# Altium schematic sheet Sheet1.SchDoc
size C; SheetNumber: 1; SheetTotal: 1
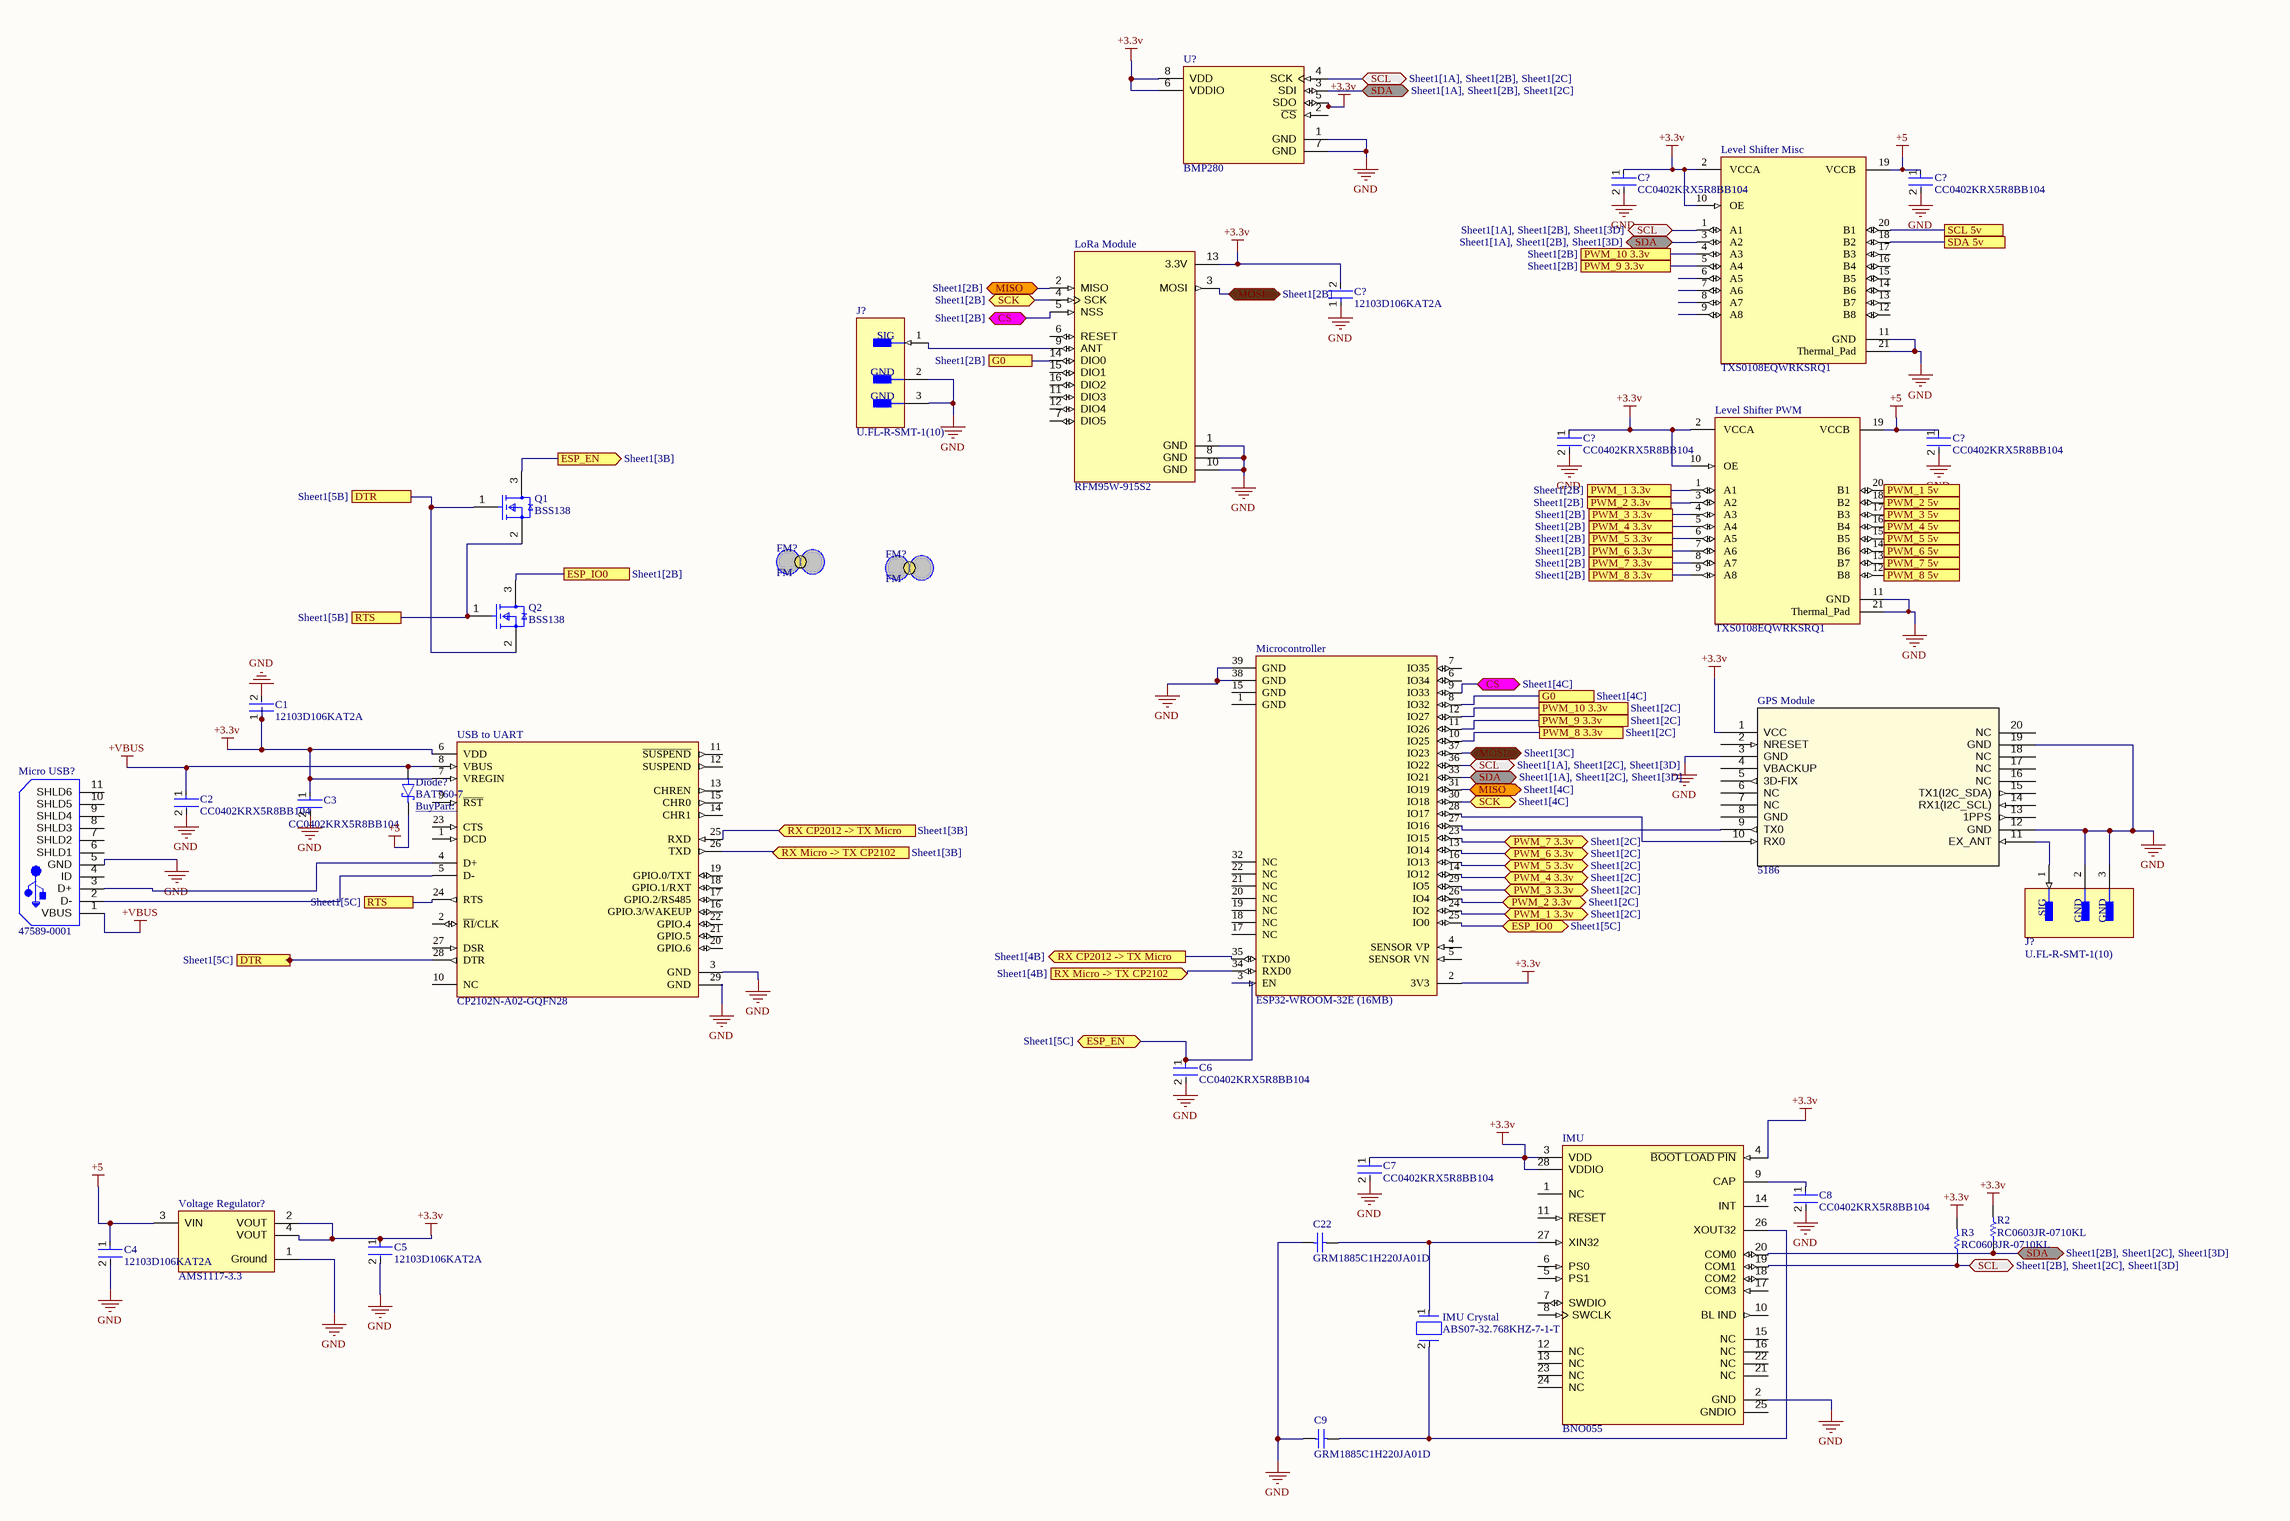
[diagram p0: Sheet1.SchDoc]

## Parts
(Parts that share a designator on the sheet are numbered #1, #2 ... from top to bottom, then left to right.)
C1  12103D106KAT2A  [FP-1210-L_3_3_0_4-W_2_5_0-MFG]
C2  CC0402KRX5R8BB104  [FP-CC0402-MFG]
C3  CC0402KRX5R8BB104  [FP-CC0402-MFG]
C4  12103D106KAT2A  [FP-1210-L_3_3_0_4-W_2_5_0-MFG]
C5  12103D106KAT2A  [FP-1210-L_3_3_0_4-W_2_5_0-MFG]
C6  CC0402KRX5R8BB104  [FP-CC0402-MFG]
C7  CC0402KRX5R8BB104  [FP-CC0402-MFG]
C8  CC0402KRX5R8BB104  [FP-CC0402-MFG]
C9  GRM1885C1H220JA01D  [CAPC1608X90X35ML10T15]
C22  GRM1885C1H220JA01D  [CAPC1608X90X35ML10T15]
C?#1  CC0402KRX5R8BB104  [FP-CC0402-MFG]
C?#2  CC0402KRX5R8BB104  [FP-CC0402-MFG]
C?#3  12103D106KAT2A  [FP-1210-L_3_3_0_4-W_2_5_0-MFG]
C?#4  CC0402KRX5R8BB104  [FP-CC0402-MFG]
C?#5  CC0402KRX5R8BB104  [FP-CC0402-MFG]
Diode?  BAT760-7  [SOD2513X120N]
FM?#1  FM  [PCBComponent_1]
FM?#2  FM  [PCBComponent_1]
GPS_Module  5186  [CD-PA1616D_ADA]
IMU  BNO055  [FP-BNO055-MFG]
IMU_Crystal  ABS07-32.768KHZ-7-1-T  [FP-ABS07-MFG]
J?#1  U.FL-R-SMT-1(10)  [FP-U_FL-R-SMT-1_10-MFG]
J?#2  U.FL-R-SMT-1(10)  [FP-U_FL-R-SMT-1_10-MFG]
Level_Shifter_Misc  TXS0108EQWRKSRQ1  [RKS0020B_MFG]
Level_Shifter_PWM  TXS0108EQWRKSRQ1  [RKS0020B_MFG]
LoRa_Module  RFM95W-915S2  [XCVR_RFM95W-915S2]
Micro_USB?  47589-0001  [MOLX-47589-0001_V]
Microcontroller  ESP32-WROOM-32E (16MB)  [FP-ESP32-WROOM-32E_16MB-MFG]
Q1  BSS138  [FP-318-08-IPC_B]
Q2  BSS138  [FP-318-08-IPC_B]
R2  RC0603JR-0710KL  [RESC1608X55X25ML10T15]
R3  RC0603JR-0710KL  [RESC1608X55X25ML10T15]
U?  BMP280  [FP-BMP280-MFG]
USB_to_UART  CP2102N-A02-GQFN28  [FP-CP2102N-A02-GQFN28-MFG]
Voltage_Regulator?  AMS1117-3.3  [FP-AMS1117-IPC_C]

## Ports
CS (bidir, see Sheet1[2B]), CS (bidir, see Sheet1[4C]), DTR (see Sheet1[5B]), DTR (see Sheet1[5C]), ESP_EN (bidir, see Sheet1[5C]), ESP_EN (out, see Sheet1[3B]), ESP_IO0 (bidir, see Sheet1[5C]), ESP_IO0 (see Sheet1[2B]), G0 (see Sheet1[2B]), G0 (see Sheet1[4C]), MISO (bidir, see Sheet1[2B]), MISO (bidir, see Sheet1[4C]), MOSI (bidir, see Sheet1[2B]), MOSI (bidir, see Sheet1[3C]), PWM_1 3.3v (bidir, see Sheet1[2C]), PWM_1 3.3v (see Sheet1[2B]), PWM_1 5v, PWM_2 3.3v (bidir, see Sheet1[2C]), PWM_2 3.3v (see Sheet1[2B]), PWM_2 5v, PWM_3 3.3v (bidir, see Sheet1[2C]), PWM_3 3.3v (see Sheet1[2B]), PWM_3 5v, PWM_4 3.3v (bidir, see Sheet1[2C]), PWM_4 3.3v (see Sheet1[2B]), PWM_4 5v, PWM_5 3.3v (bidir, see Sheet1[2C]), PWM_5 3.3v (see Sheet1[2B]), PWM_5 5v, PWM_6 3.3v (bidir, see Sheet1[2C]), PWM_6 3.3v (see Sheet1[2B]), PWM_6 5v, PWM_7 3.3v (bidir, see Sheet1[2C]), PWM_7 3.3v (see Sheet1[2B]), PWM_7 5v, PWM_8 3.3v (see Sheet1[2B]), PWM_8 3.3v (see Sheet1[2C]), PWM_8 5v, PWM_9 3.3v (see Sheet1[2B]), PWM_9 3.3v (see Sheet1[2C]), PWM_10 3.3v (see Sheet1[2B]), PWM_10 3.3v (see Sheet1[2C]), RTS (see Sheet1[5B]), RTS (see Sheet1[5C]), RX CP2012 -> TX Micro (in, see Sheet1[3B]), RX CP2012 -> TX Micro (out, see Sheet1[4B]), RX Micro -> TX CP2102 (in, see Sheet1[3B]), RX Micro -> TX CP2102 (in, see Sheet1[4B]), SCK (bidir, see Sheet1[2B]), SCK (bidir, see Sheet1[4C]), SCL 5v, SCL (bidir, see Sheet1[1A], Sheet1[2B], Sheet1[2C]), SCL (bidir, see Sheet1[1A], Sheet1[2B], Sheet1[3D]), SCL (bidir, see Sheet1[1A], Sheet1[2C], Sheet1[3D]), SCL (bidir, see Sheet1[2B], Sheet1[2C], Sheet1[3D]), SDA 5v, SDA (bidir, see Sheet1[1A], Sheet1[2B], Sheet1[2C]), SDA (bidir, see Sheet1[1A], Sheet1[2B], Sheet1[3D]), SDA (bidir, see Sheet1[1A], Sheet1[2C], Sheet1[3D]), SDA (bidir, see Sheet1[2B], Sheet1[2C], Sheet1[3D])

## Nets
+3.3v: C1.1 C3.1 C5.1 C7.1 C?#1.1 C?#3.2 C?#4.1 GPS_Module.1(VCC) IMU.3(VDD) IMU.4(~{BOOT_LOAD_PIN}) IMU.28(VDDIO) Level_Shifter_Misc.2(VCCA) Level_Shifter_Misc.10(OE) Level_Shifter_PWM.2(VCCA) Level_Shifter_PWM.10(OE) LoRa_Module.13(3.3V) Microcontroller.2(3V3) R2.2 R3.2 U?.5(SDO) U?.6(VDDIO) U?.8(VDD) USB_to_UART.6(VDD) USB_to_UART.7(VREGIN) Voltage_Regulator?.2(VOUT) Voltage_Regulator?.4(VOUT)
+5: C4.1 C?#2.1 C?#5.1 Diode?.C(K) Level_Shifter_Misc.19(VCCB) Level_Shifter_PWM.19(VCCB) Voltage_Regulator?.3(VIN)
+VBUS: C2.1 Diode?.A Micro_USB?.1(VBUS) USB_to_UART.8(VBUS)
GND: C1.2 C2.2 C3.2 C4.2 C5.2 C6.2 C7.2 C8.2 C9.1 C22.1 C?#1.2 C?#2.2 C?#3.1 C?#4.2 C?#5.2 GPS_Module.3(GND) GPS_Module.12(GND) GPS_Module.19(GND) IMU.2(GND) J?#1.2(GND) J?#1.3(GND) J?#2.2(GND) J?#2.3(GND) Level_Shifter_Misc.11(GND) Level_Shifter_Misc.21(Thermal_Pad) Level_Shifter_PWM.11(GND) Level_Shifter_PWM.21(Thermal_Pad) LoRa_Module.1(GND) LoRa_Module.8(GND) LoRa_Module.10(GND) Micro_USB?.5(GND) Microcontroller.38(GND) Microcontroller.39(GND) U?.1(GND) U?.7(GND) USB_to_UART.3(GND) USB_to_UART.29(GND) Voltage_Regulator?.1(Ground)
CS: LoRa_Module.5(NSS) Microcontroller.9(IO33) ; port CS
DTR: Q1.1(G) Q2.2(S) USB_to_UART.28(DTR) ; port DTR
ESP_EN: C6.1 Microcontroller.3(EN) Q1.3(D) ; port ESP_EN
ESP_IO0: Microcontroller.25(IO0) Q2.3(D) ; port ESP_IO0
G0: LoRa_Module.14(DIO0) Microcontroller.8(IO32) ; port G0
MISO: LoRa_Module.2(MISO) Microcontroller.31(IO19) ; port MISO
MOSI: LoRa_Module.3(MOSI) Microcontroller.37(IO23) ; port MOSI
PWM_1 3.3v: Level_Shifter_PWM.1(A1) Microcontroller.24(IO2) ; port PWM_1 3.3v
PWM_1 5v: Level_Shifter_PWM.20(B1) ; port PWM_1 5v
PWM_2 3.3v: Level_Shifter_PWM.3(A2) Microcontroller.26(IO4) ; port PWM_2 3.3v
PWM_2 5v: Level_Shifter_PWM.18(B2) ; port PWM_2 5v
PWM_3 3.3v: Level_Shifter_PWM.4(A3) Microcontroller.29(IO5) ; port PWM_3 3.3v
PWM_3 5v: Level_Shifter_PWM.17(B3) ; port PWM_3 5v
PWM_4 3.3v: Level_Shifter_PWM.5(A4) Microcontroller.14(IO12) ; port PWM_4 3.3v
PWM_4 5v: Level_Shifter_PWM.16(B4) ; port PWM_4 5v
PWM_5 3.3v: Level_Shifter_PWM.6(A5) Microcontroller.16(IO13) ; port PWM_5 3.3v
PWM_5 5v: Level_Shifter_PWM.15(B5) ; port PWM_5 5v
PWM_6 3.3v: Level_Shifter_PWM.7(A6) Microcontroller.13(IO14) ; port PWM_6 3.3v
PWM_6 5v: Level_Shifter_PWM.14(B6) ; port PWM_6 5v
PWM_7 3.3v: Level_Shifter_PWM.8(A7) Microcontroller.23(IO15) ; port PWM_7 3.3v
PWM_7 5v: Level_Shifter_PWM.13(B7) ; port PWM_7 5v
PWM_8 3.3v: Level_Shifter_PWM.9(A8) Microcontroller.10(IO25) ; port PWM_8 3.3v
PWM_8 5v: Level_Shifter_PWM.12(B8) ; port PWM_8 5v
PWM_9 3.3v: Level_Shifter_Misc.5(A4) Microcontroller.11(IO26) ; port PWM_9 3.3v
PWM_10 3.3v: Level_Shifter_Misc.4(A3) Microcontroller.12(IO27) ; port PWM_10 3.3v
RTS: Q1.2(S) Q2.1(G) USB_to_UART.24(RTS) ; port RTS
RX CP2012 -> TX Micro: Microcontroller.35(TXD0) USB_to_UART.25(RXD) ; port RX CP2012 -> TX Micro
RX Micro -> TX CP2102: Microcontroller.34(RXD0) USB_to_UART.26(TXD) ; port RX Micro -> TX CP2102
SCK: LoRa_Module.4(SCK) Microcontroller.30(IO18) ; port SCK
SCL: IMU.19(COM1) Level_Shifter_Misc.1(A1) Microcontroller.36(IO22) R3.1 U?.4(SCK) ; port SCL
SCL 5v: Level_Shifter_Misc.20(B1) ; port SCL 5v
SDA: IMU.20(COM0) Level_Shifter_Misc.3(A2) Microcontroller.33(IO21) R2.1 U?.3(SDI) ; port SDA
SDA 5v: Level_Shifter_Misc.18(B2) ; port SDA 5v
NetC8_1: C8.1 IMU.9(CAP)
NetC9_2: C9.2 IMU.26(XOUT32) IMU_Crystal.2
NetC22_2: C22.2 IMU.27(XIN32) IMU_Crystal.1
NetGPS_Module_9: GPS_Module.9(TX0) Microcontroller.27(IO16)
NetGPS_Module_10: GPS_Module.10(RX0) Microcontroller.28(IO17)
NetGPS_Module_11: GPS_Module.11(EX_ANT) J?#2.1(SIG)
NetJ?#1_1: J?#1.1(SIG) LoRa_Module.9(ANT)
NetMicro_USB?_2: Micro_USB?.2(D-) USB_to_UART.5(D-)
NetMicro_USB?_3: Micro_USB?.3(D+) USB_to_UART.4(D+)

Not connected (* = marked no-connect by the designer): GPS_Module 2(NRESET) 4(VBACKUP) 5(3D-FIX) 6(NC) 7(NC) 8(GND) 13(1PPS) 14(RX1(I2C_SCL)) 15(TX1(I2C_SDA)) 16(NC) 17(NC) 18(NC) 20(NC); IMU 1(NC) 5(PS1) 6(PS0) 7(SWDIO) 8(SWCLK) 10(BL_IND) 11(~{RESET}) 12(NC) 13(NC) 14(INT) 15(NC) 16(NC) 17(COM3) 18(COM2) 21(NC) 22(NC) 23(NC) 24(NC) 25(GNDIO); Level_Shifter_Misc 6(A5) 7(A6) 8(A7) 9(A8) 12(B8) 13(B7) 14(B6) 15(B5) 16(B4) 17(B3); LoRa_Module 6(RESET) 7(DIO5) 11(DIO3) 12(DIO4) 15(DIO1) 16(DIO2); Micro_USB? 4(ID) 6(SHLD1) 7(SHLD2) 8(SHLD3) 9(SHLD4) 10(SHLD5) 11(SHLD6); Microcontroller 1(GND) 4(SENSOR_VP) 5(SENSOR_VN) 6(IO34) 7(IO35) 15(GND) 17(NC) 18(NC) 19(NC) 20(NC) 21(NC) 22(NC) 32(NC); U? 2(~{CS}); USB_to_UART 1(DCD) 2(~{RI}/CLK) 9(~{RST}) 10(NC) 11(~{SUSPEND}) 12(SUSPEND) 13(CHREN) 14(CHR1) 15(CHR0) 16(GPIO.3/WAKEUP) 17(GPIO.2/RS485) 18(GPIO.1/RXT) 19(GPIO.0/TXT) 20(GPIO.6) 21(GPIO.5) 22(GPIO.4) 23(CTS) 27(DSR)

## Notes on the sheet
- DWG. NO.
- REV.
- SHT.
- THIS DOCUMENT AND THE DATA DISCLOSED HEREIN OR HEREWITH IS THE PROPERTY OF ALTIUM LIMITED AND MAY BE FREELY DISTRIBUTED IN WHOLE. NO RIGHTS ARE RESERVED OR EXPRESS OR IMPLIED WARANTEE GIVEN.
- REVISION
- DESCRIPTION
- DATE
- APPROVED
- ENG:
- APPROVALS
- PROJECT
- DSN:
- CHK:
- REFERENCE DOCUMENTS
- PROJECT REVISION:
- TITLE
- DOCUMENT REVISION:
- DESIGN ITEM:
- BOM:
- FAB DWG:
- PCB DWG:
- ASSY DWG:
- SCALE:
- SIZE
- B
- CAGE CODE
- FILE NAME
- DWG NO.
- SHEET
- OF
- REV

## Library data of the parts
C1 C4 C5 C?#3 = CMP-2000-05477-2: General Purpose Ceramic Capacitor, 1210, 10uF, 10%, X5R, 15%, 25V; Lead Free: Lead Free; Max Operating Temperature: 85°C; REACH SVHC: No SVHC; Depth: 2.5mm; Packaging: Tape and Reel; Min Operating Temperature: -55°C; Height: 2.29mm; Construction: Flat; Case Code (Imperial): 1210; Radiation Hardening: No; Voltage: 25V; Case/Package: 1210; Series: -; Dielectric: X5R; Length: 3.2mm; Thickness: 0.11inch; Package Quantity: 1; Termination: SMD/SMT; Case Code (Metric): 3225; Voltage Rating (DC): 25V; Voltage Rating: 25V; Contact Plating: Tin; RoHS Compliant: Yes; Mount: Surface Mount; Width: 0.098inch; Capacitance: 10uF; Tolerance: 10%
C2 C3 C6-C8 C?#1 C?#2 C?#4 C?#5 = CMP-03422-000607-1: CAP CER 0.1UF 25V X5R 0402; Manufacturer: YAGEO; Tolerance: 0.1; Value: 100 nF; Material: Ceramic; Automotive Grade: NA; Temperature Coefficient: 30ppm/°C; Height: 0.55mm; Voltage Rating: 25 V; Octopart: https://octopart.com/cc0402krx5r8bb104-yageo-20779263; Mouser Description: Multilayer Ceramic Capacitors MLCC - SMD/SMT 100nF 25V X5R 10%; Category: Cap; Lead Free: Yes; Device Class L2: Capacitors; Device Class L1: Passive Components; Digikey Description: CAP CER 0.1UF 25V X5R 0402; Device Class L3: Ceramic Capacitors; Temperature: -55°C to +125°C; Ipc Land Pattern Name: CAPC10050X50; Automotive: No; Package: CC0402; Temperature Range High: +125°C; RoHS: TRUE; ComponentLink2Description: Datasheet; Footprint Url: http://www.yageo.com/exep/pages/download/literatures/UPY-C_GEN_24.pdf; Capacitance: 100 nF; ComponentLink2URL: http://www.yageo.com/documents/recent/UPY-GP_NP0_16V-to-50V_16.pdf; Temperature Range Low: -55°C; Temperature Characteristic: X5R; Manufacturer Part Number: CC0402KRX5R8BB104
C9 C22 = CMP-2000-04945-1: Chip Capacitor, 22 pF, +/- 5%, 50 V, -55 to 125 degC, 0603 (1608 Metric), RoHS, Tape and Reel; Manufacturer: Murata; Capacitance: 22pF; Rated Voltage: 50V; Dielectric: C0G; Manufacturer URL: http://www.murata.com/; Datasheet Version: Jul-06; Package Reference: 603; Tolerance (%): ±5%; Case Size/Dimension: 0603; Package Description: 2-Pin Surface Mount Device, Body 1.6 x 0.8 mm; Datasheet URL: https://datasheet.ciiva.com/11786/0900766b807a1cab-11786398.pdf
Diode? = BAT760-7: Diode Schottky 30V 1A 2-Pin SOD-323 T/R; MF: Diodes Zetex; MP: BAT760-7; SnapEDA_Link: https://www.snapeda.com/parts/BAT760-7/Zetex/view-part/4817231/?ref=snap; Value: *; DigiKey-Purchase-URL: https://snapeda.com/shop?store=DigiKey&id=4817231; Package: None; Mouser-Purchase-URL: https://snapeda.com/shop?store=Mouser&id=4817231; Price: None; Availability: Good
FM?#1 FM?#2 = FM?
GPS_Module = 5186: No Description Available; Mfr_Name: Adafruit Industries; RefDes: RefDes; Type: Type
IMU = CMP-2000-05075-4: IMU ACCEL/GYRO/MAG I2C 28LGA; Sensor Type: Accelerometer; Packaging: Tape and Reel; Case/Package: LGA; Min Operating Temperature: -40°C; Mount: Surface Mount; Output Type: I2C; Lead Free: Lead Free; Max Operating Temperature: 85°C
IMU_Crystal = CMP-27762-015873-1: Crystal 32.768kHz ±10ppm (Tol) 7pF FUND 70kΩ 2-Pin CSMD T/R; ESR (Equivalent Series Resistance): 70kR; Min Operating Temperature: -40°C; Height: 0.035inch; Max Operating Temperature: 85°C; Length: 0.126inch; RoHS Compliant: Yes; Width: 0.061inch; Frequency Tolerance: 10ppm; Lead Free: Lead Free; Operating Frequency: 32.768 kHz; Packaging: Cut Tape; Series: ABS07; Case/Package: SMD/SMT; Frequency: 32.768kHz; Load Capacitance: 7pF; Mount: Surface Mount
J?#1 J?#2 = CMP-2000-05152-3: CONN U.FL RCPT STR 50 OHM SMD; Max Frequency: 6GHz; Connector Type: Coaxial; Body Plating: Silver; Body Material: Bronze; Impedance: 50R; Dielectric Material: Polymer; Insulation Resistance: 500MR; Gender: Male; Packaging: Cut Tape; Length: 3mm; Package Quantity: 2500; Termination: Solder; Lead Free: Lead Free; Series: U.FL; Min Operating Temperature: -40°C; Fastening Type: Snap; Contact Material: Brass; Orientation: Straight; Wire/Cable Type: Coaxial; Frequency: 6GHz; Contact Plating: Gold; Depth: 3.1mm; Weight: 0.001764oz; Max Operating Temperature: 90°C; Radiation Hardening: No; REACH SVHC: No SVHC; Mount: Surface Mount; Housing Color: Beige
Level_Shifter_Misc Level_Shifter_PWM = CMP-00370-160082524-1: Automotive eight-bit bidirectional voltage level shifter for open-drain and push-pull applications 20-VQFN -40 to 125; Manufacturer Lifecycle Status: ACTIVE; Number of Bits: 8; Height: 0m; Number of Pins: 20; Length: 4.5mm; Width: 2.5mm; ComponentLink1URL: http://ti.com; HelpURL: https://www.ti.com/lit/ds/symlink/txs0108e-q1.pdf; RoHS: Compliant; Case/Package: VQFN; ComponentLink2URL: https://www.ti.com/lit/ds/symlink/txs0108e-q1.pdf; Thickness: 900µm; ComponentLink2Description: Datasheet URL; Lifecycle Status: Production; ComponentLink1Description: Manufacturer's Website
LoRa_Module = RFM95W-915S2: RFM95(W) - Low Power Long Range Transceiver Module V1.0; Availability: Unavailable; MP: RFM95W-915S2; Value: *; Package: None; Price: None
Micro_USB? = CMP-2000-05610-1: Right Angle Female Type AB Micro USB Connector, 30 V, 1.8 A, -30 to 85 degC, RoHS, Tape and Reel; Number of Ports: 1Port; Current Rating: 1.8A; Brand: Molex; Connector Type: MicroUSBTypeABreceptacle; Number of Contacts: 5Contact; Voltage Rating: 30VAC; Color: Black; Product: MicroUSBTypeABConnectors; Package URL: http://www.molex.com/pdm_docs/sd/475890001_sd.pdf; Contact Plating: Gold; Datasheet URL: http://www.molex.com/webdocs/datasheets/pdf/en-us/0475890001_IO_CONNECTORS.pdf; Operating Temperature Range: -20Cto+85C; Termination Style: SMD/SMT; Mounting Angle: Right; Package Reference: 47589-0001; Gender: Female; Package Description: Micro USB Connector, Pitch 0.65 mm, 5 Positions, Body 7.5 x 5.6 mm; Mounting Technology: SurfaceMount; Contact Material: CopperAlloy; Packaging: Reel; RoHS: True; Standard: USB; Manufacturer URL: http://www.molex.com/; Manufacturer: Molex; Datasheet Version: 12/2016; Product Category: USBConnectors; Series: 47589
Microcontroller = CMP-194065-000027-1: RX TXRX MOD WIFI TRACE ANT SMD
Q1 Q2 = CMP-07173-000101-1: MOSFET N-CH 50V 220MA SOT-23; Turn-Off Delay Time: 20ns; Element Configuration: Single; Rds On Max: 3.5R; Gate to Source Voltage (Vgs): 20V; Threshold Voltage: 1.3V; Number of Elements: 1; Power Dissipation: 360mW; Rise Time: 9ns; Turn-On Delay Time: 2.5ns; Input Capacitance: 27pF; On-State Resistance: 6R; Lead Free: Lead Free; Length: 2.92mm; Width: 1.3mm; Drain to Source Breakdown Voltage: 50V; Min Operating Temperature: -55°C; REACH SVHC: No SVHC; Packaging: Tape and Reel; Radiation Hardening: No; Height: 0.93mm; Drain to Source Voltage (Vdss): 50V; Current Rating: 220mA; Voltage Rating (DC): 50V; Weight: 0.03g; Continuous Drain Current (ID): 220mA; Number of Pins: 3; Nominal Vgs: 1.3V; Max Power Dissipation: 360mW; Fall Time: 9ns; Drain to Source Resistance: 3.5R; Contact Plating: Tin; Case/Package: SOT-23; Package Quantity: 1; Dual Supply Voltage: 50V; Mount: Surface Mount; Termination: SMD/SMT; Max Operating Temperature: 150°C
R2 R3 = CMP-2000-05022-1: Resistor, 10 KOhm, +/- 5%, 100 mW, -55 to 155 degC, 0603 (1608 Metric), RoHS, Tape and Reel; Manufacturer: Yageo; Resistance: 10kOhms; Voltage Rating: 50V; Temperature Coefficient: 100PPM/C; Power Rating: 100mW; Package Reference: 603; Series: RC; Case Code - mm: 1608; Packaging: Reel; Datasheet URL: http://www.farnell.com/datasheets/443971.pdf; Datasheet Version: Rev. 4, 04/2009; Operating Temperature Range: -55Cto+155C; Product: ThickFilmResistorsGeneralPurpose; Package Description: 2-Pin Surface Mount Device, Body 1.6 x 0.8 mm; Manufacturer URL: http://www.yageo.com/; Case Code - in: 0603; Tolerance: 5%; Termination Style: SMD/SMT
U? = CMP-2000-05076-3: SENSOR PRESSURE ABS; Operating Pressure: 15.95PSI; Pressure Type: Absolute; Output Type: SPI; Max Pressure: 290.08PSI; Port Style: No Port; Case/Package: SMD/SMT; Lead Free: Lead Free; Termination: SMD/SMT; Min Operating Temperature: -40°C; Number of Pins: 8; Max Operating Temperature: 85°C
USB_to_UART = CMP-08093-000005-1: IC USB TO UART BRIDGE QFN28
Voltage_Regulator? = CMP-209535-000001-1: LDO Voltage Regulators 1A, 3.3V; Manufacturer: Advanced Monolithic Systems; Dropout Voltage: 1.1V; Output Type: Fixed; Nominal Supply Current: 5mA; Max Power Dissipation: 1.2W; Max Supply Voltage: 15V; Number Of Outputs: 1; Standoff Height: 0.64mm; Max Junction Temp: +125°C; Height: 1.8mm; Package: AMS1117; Device Class L2: Power Management ICs; ComponentLink2Description: Datasheet; ComponentLink2URL: http://www.advanced-monolithic.com/pdf/ds1117.pdf; Category: IC; RoHS: TRUE; Automotive: No; Device Class L1: Integrated Circuits (ICs); Output Current: 1A; Device Class L3: Voltage Regulators - Linear; Temperature: -40°C to +125°C; Output Voltage: 3.3V; Manufacturer Part Number: AMS1117-3.3; Temperature Range Low: -40°C; Octopart: https://octopart.com/ams1117-3.3-advanced+monolithic+systems-25899300; Lead Free: Yes; Ipc Land Pattern Name: SOT229P700X180-4; Temperature Range High: +125°C